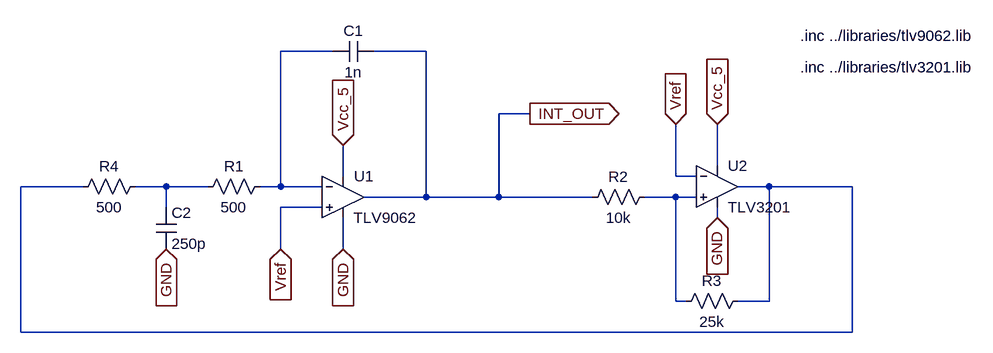
[diagram p0: schematic triangle_wave_gen.asc]
triangle_wave_gen.asc, the LTspice schematic file:
Version 4
SHEET 1 1432 836
WIRE -176 -16 -256 -16
WIRE -32 -16 -112 -16
WIRE 128 80 80 80
WIRE 416 160 416 96
WIRE -160 176 -160 128
WIRE 352 176 352 96
WIRE 384 176 352 176
WIRE -560 192 -656 192
WIRE -432 192 -480 192
WIRE -368 192 -432 192
WIRE -256 192 -256 -16
WIRE -256 192 -288 192
WIRE -192 192 -256 192
WIRE 496 192 448 192
WIRE 624 192 496 192
WIRE -32 208 -32 -16
WIRE -32 208 -128 208
WIRE 80 208 80 80
WIRE 80 208 -32 208
WIRE 224 208 80 208
WIRE 352 208 304 208
WIRE 384 208 352 208
WIRE -432 224 -432 192
WIRE -192 224 -256 224
WIRE 416 240 416 224
WIRE -256 288 -256 224
WIRE -160 288 -160 240
WIRE 352 368 352 208
WIRE 368 368 352 368
WIRE 496 368 496 192
WIRE 496 368 448 368
WIRE -656 416 -656 192
WIRE 624 416 624 192
WIRE 624 416 -656 416
FLAG -256 288 Vref
IOPIN -256 288 In
FLAG 352 96 Vref
IOPIN 352 96 In
FLAG 416 96 Vcc_5
IOPIN 416 96 In
FLAG -160 128 Vcc_5
IOPIN -160 128 In
FLAG 128 80 INT_OUT
IOPIN 128 80 Out
FLAG -432 288 GND
IOPIN -432 288 In
FLAG 416 240 GND
IOPIN 416 240 In
FLAG -160 288 GND
IOPIN -160 288 In
SYMBOL OpAmps\\opamp2 -160 144 R0
WINDOW 0 32 32 Center 2
SYMATTR InstName U1
SYMATTR Value TLV9062
SYMBOL OpAmps\\opamp2 416 128 R0
SYMATTR InstName U2
SYMATTR Value TLV3201
SYMBOL cap -112 -32 R90
WINDOW 0 0 32 VBottom 2
WINDOW 3 32 32 VTop 2
SYMATTR InstName C1
SYMATTR Value 1n
SYMBOL res -272 176 R90
WINDOW 0 0 56 VBottom 2
WINDOW 3 32 56 VTop 2
SYMATTR InstName R1
SYMATTR Value 500
SYMBOL res 320 192 R90
WINDOW 0 0 56 VBottom 2
WINDOW 3 32 56 VTop 2
SYMATTR InstName R2
SYMATTR Value 10k
SYMBOL res 464 352 R90
WINDOW 0 0 56 VBottom 2
WINDOW 3 32 56 VTop 2
SYMATTR InstName R3
SYMATTR Value 25k
SYMBOL res -464 176 R90
WINDOW 0 0 56 VBottom 2
WINDOW 3 32 56 VTop 2
SYMATTR InstName R4
SYMATTR Value 500
SYMBOL cap -448 224 R0
SYMATTR InstName C2
SYMATTR Value 250p
TEXT 544 -40 Left 2 !.inc ../libraries/tlv9062.lib
TEXT 544 8 Left 2 !.inc ../libraries/tlv3201.lib

The netlist it stands for:
* triangle_wave_gen.asc
XU1 Vref N001 Vcc_5 GND INT_OUT TLV9062  ; pins In+ In- V+ V- OUT
XU2 N004 Vref Vcc_5 GND N002 TLV3201  ; pins In+ In- V+ V- OUT
C1 INT_OUT N001 1n
R1 N001 N003 500
R2 N004 INT_OUT 10k
R3 N002 N004 25k
R4 N003 N002 500
C2 N003 GND 250p
.inc ../libraries/tlv9062.lib
.inc ../libraries/tlv3201.lib
.backanno
.end